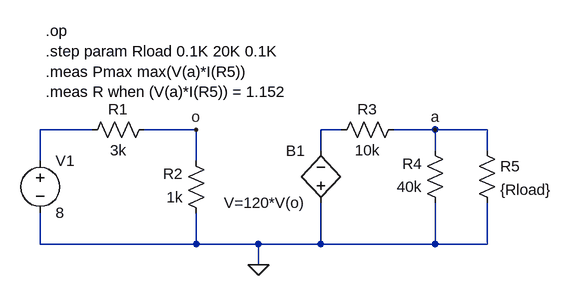
[diagram p0: schematic MaximaPotencia.asc]
MaximaPotencia.asc, the LTspice schematic file:
Version 4
SHEET 1 880 680
WIRE 80 96 0 96
WIRE 240 96 160 96
WIRE 464 96 432 96
WIRE 608 96 544 96
WIRE 688 96 608 96
WIRE 432 128 432 96
WIRE 608 128 608 96
WIRE 688 128 688 96
WIRE 0 144 0 96
WIRE 240 144 240 96
WIRE 0 272 0 224
WIRE 240 272 240 224
WIRE 240 272 0 272
WIRE 336 272 240 272
WIRE 432 272 432 208
WIRE 432 272 336 272
WIRE 608 272 608 208
WIRE 608 272 432 272
WIRE 688 272 688 208
WIRE 688 272 608 272
WIRE 336 304 336 272
FLAG 336 304 0
FLAG 240 96 o
FLAG 608 96 a
SYMBOL voltage 0 128 R0
WINDOW 123 0 0 Left 0
WINDOW 39 0 0 Left 0
SYMATTR InstName V1
SYMATTR Value 8
SYMBOL res 176 80 R90
WINDOW 0 0 56 VBottom 2
WINDOW 3 32 56 VTop 2
SYMATTR InstName R1
SYMATTR Value 3k
SYMBOL res 256 240 R180
WINDOW 0 36 76 Left 2
WINDOW 3 36 40 Left 2
SYMATTR InstName R2
SYMATTR Value 1k
SYMBOL res 560 80 R90
WINDOW 0 0 56 VBottom 2
WINDOW 3 32 56 VTop 2
SYMATTR InstName R3
SYMATTR Value 10k
SYMBOL res 624 224 R180
WINDOW 0 36 76 Left 2
WINDOW 3 36 40 Left 2
SYMATTR InstName R4
SYMATTR Value 40k
SYMBOL res 672 112 R0
SYMATTR InstName R5
SYMATTR Value {Rload}
SYMBOL bv 432 224 R180
WINDOW 0 24 96 Left 2
WINDOW 3 24 16 Left 2
SYMATTR InstName B1
SYMATTR Value V=120*V(o)
TEXT 8 -56 Left 2 !.op\n.step param Rload 0.1K 20K 0.1K\n.meas Pmax max(V(a)*I(R5))\n.meas R when (V(a)*I(R5)) = 1.152

The netlist it stands for:
* MaximaPotencia.asc
V1 N001 0 8
R1 o N001 3k
R2 0 o 1k
R3 a N002 10k
R4 0 a 40k
R5 a 0 {Rload}
B1 0 N002 V=120*V(o)
.op
.step param Rload 0.1K 20K 0.1K
.meas Pmax max(V(a)*I(R5))
.meas R when (V(a)*I(R5)) = 1.152
.backanno
.end